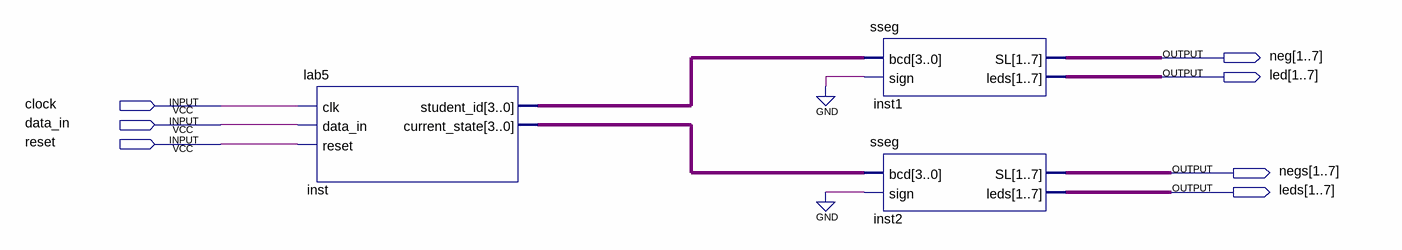
[diagram p0: schematic sheet]
// Quartus schematic lab5_sseg.bdf as structural Verilog: 3 symbols, 7 pins
module lab5_sseg (
  input  clock,
  input  data_in,
  input  reset,
  output [1:7] neg,
  output [1:7] led,
  output [1:7] negs,
  output [1:7] leds
);

  wire [3:0] inst_current_state, inst_student_id;

  lab5 inst (
    .clk(clock), .data_in(data_in), .reset(reset), .student_id(inst_student_id),
    .current_state(inst_current_state));
  sseg inst1 (.bcd(inst_student_id), .sign(1'b0), .SL(neg), .leds(led));
  sseg inst2 (.bcd(inst_current_state), .sign(1'b0), .SL(negs), .leds(leds));
endmodule
